# EAGLE design LCDClock (EAGLE 7.6.0)
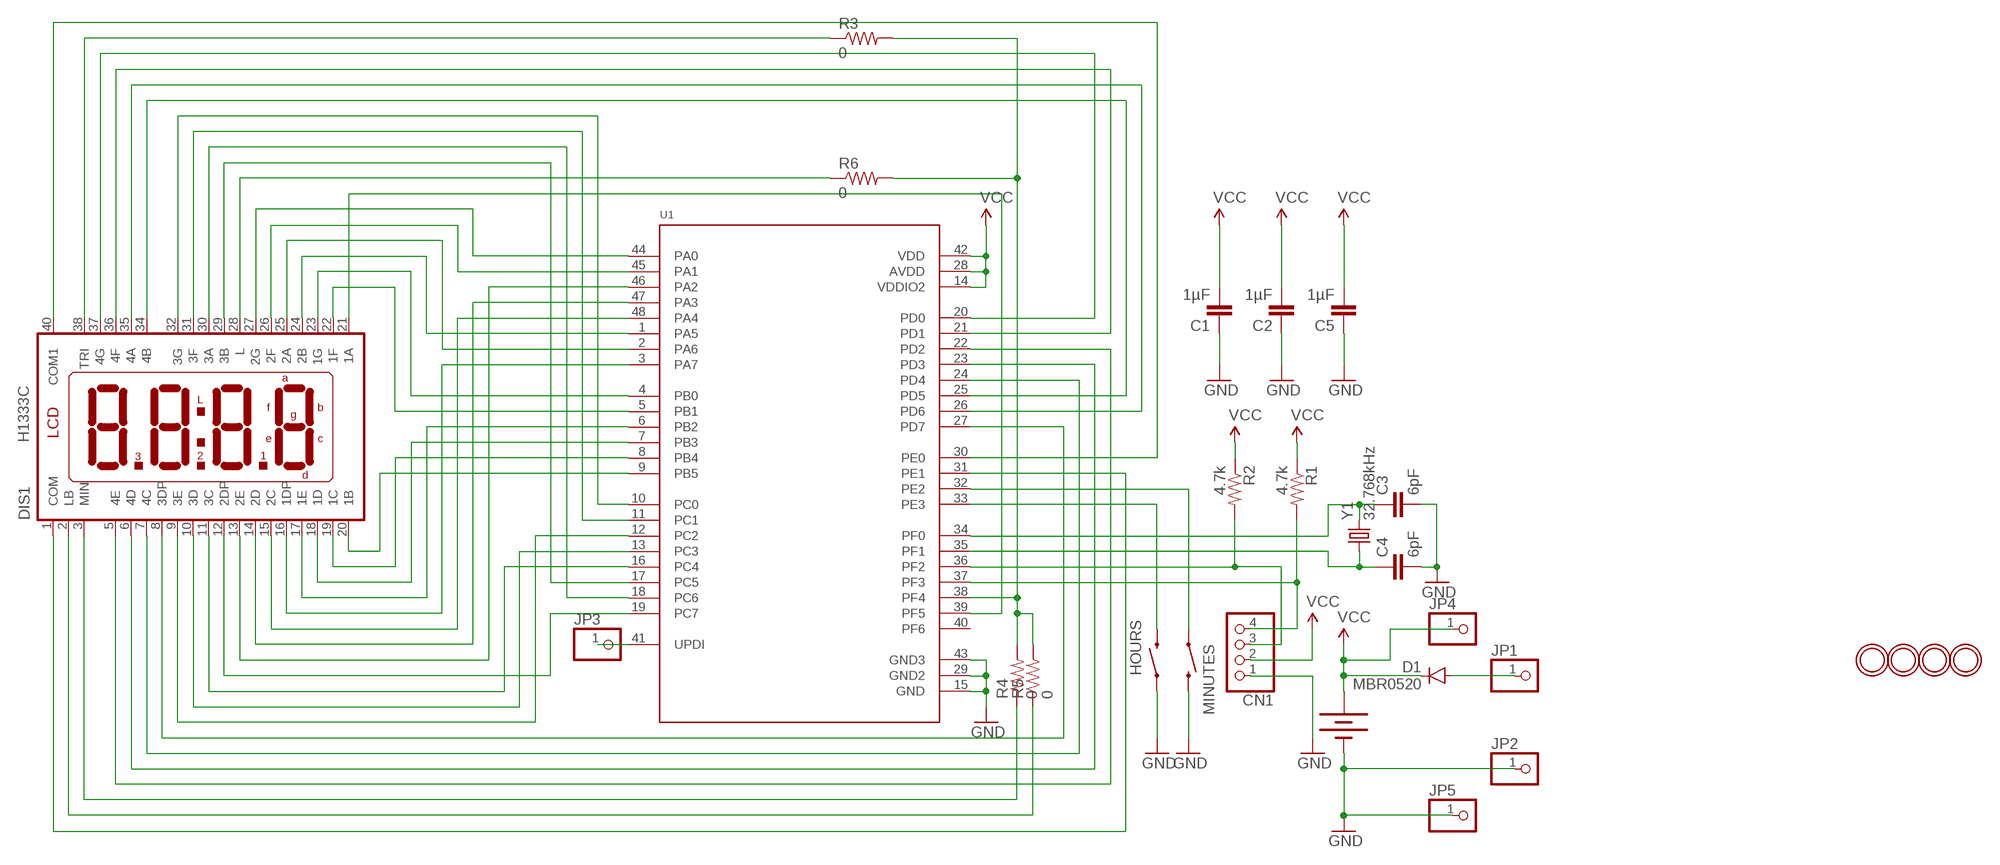
[diagram p0: schematic, sheet 1]

## Parts
BAT1  20mm coincell  BATTERY20MM_4LEGS  [BATTCON_20MM_4LEGS]
C1  1µF  CAP0805  [0805]
C2  1µF  CAP0805  [0805]
C3  6pF  CAP0805  [0805]
C4  6pF  CAP0805  [0805]
C5  1µF  CAP0805  [0805]
CN1  JST_4PIN  [JSTPH4]
D1  MBR0520  DIODESOD123  [SOD-123]
DIS1  H1333C  [H1333C]
HOURS  SWITCH-MOMENTARY-2SMD-4  [TACTILE_SWITCH_TALL]
JP1  HEADER-1X1ROUND  [1X01_ROUND]
JP2  HEADER-1X1ROUND  [1X01_ROUND]
JP3  HEADER-1X1ROUND  [1X01_ROUND]
JP4  HEADER-1X12MM  [1X01_2MM]
JP5  HEADER-1X12MM  [1X01_2MM]
MINUTES  SWITCH-MOMENTARY-2SMD-4  [TACTILE_SWITCH_TALL]
R1  4.7k  0.3OHM-1/8W-1%(0805)  [0805]
R2  4.7k  0.3OHM-1/8W-1%(0805)  [0805]
R3  0  0.3OHM-1/8W-1%(0805)  [0805]
R4  0  0.3OHM-1/8W-1%(0805)  [0805]
R5  0  0.3OHM-1/8W-1%(0805)  [0805]
R6  0  0.3OHM-1/8W-1%(0805)  [0805]
U1  AVR128DB48  [LQFP48]
U$1  MOUNTINGHOLE2.5  [MOUNTINGHOLE_2.5_PLATED]
U$4  MOUNTINGHOLE2.5  [MOUNTINGHOLE_2.5_PLATED]
U$5  MOUNTINGHOLE2.5  [MOUNTINGHOLE_2.5_PLATED]
U$9  MOUNTINGHOLE2.5  [MOUNTINGHOLE_2.5_PLATED]
Y1  32.768kHz  CRYSTAL3.2X1.5MM  [CRYSTAL-SMD-3.2X1.5MM]

## Nets
GND: BAT1.NEGATIVE(-) C1.1 C2.1 C3.2 C4.2 C5.1 CN1.1 HOURS.A2 JP2.1 JP5.1 MINUTES.B2 U1.15(GND) U1.29(GND2) U1.43(GND3)
N$1: DIS1.23(1G) U1.4(PB0)
N$2: DIS1.22(1F) U1.5(PB1)
N$3: DIS1.17(1E) U1.6(PB2)
N$4: DIS1.18(1D) U1.7(PB3)
N$5: DIS1.19(1C) U1.8(PB4)
N$6: DIS1.20(1B) U1.9(PB5)
N$7: DIS1.24(2B) U1.1(PA5)
N$8: DIS1.25(2A) U1.2(PA6)
N$9: DIS1.26(2F) U1.45(PA1)
N$10: MINUTES.A2 U1.32(PE2)
N$11: DIS1.27(2G) U1.44(PA0)
N$12: DIS1.16(1DP) U1.3(PA7)
N$13: HOURS.B2 U1.33(PE3)
N$14: DIS1.15(2C) U1.48(PA4)
N$15: DIS1.14(2D) U1.47(PA3)
N$16: DIS1.13(2E) U1.46(PA2)
N$17: DIS1.12(2DP) U1.19(PC7)
N$18: DIS1.11(3C) U1.16(PC4)
N$19: DIS1.10(3D) U1.13(PC3)
N$20: DIS1.9(3E) U1.12(PC2)
N$21: DIS1.29(3B) U1.17(PC5)
N$22: DIS1.30(3A) U1.18(PC6)
N$23: DIS1.31(3F) U1.11(PC1)
N$24: DIS1.32(3G) U1.10(PC0)
N$25: DIS1.34(4B) U1.25(PD5)
N$26: DIS1.35(4A) U1.26(PD6)
N$27: CN1.3 R2.2 U1.36(PF2)
N$28: DIS1.36(4F) U1.21(PD1)
N$29: CN1.4 R1.2 U1.37(PF3)
N$30: DIS1.37(4G) U1.20(PD0)
N$31: DIS1.8(3DP) U1.27(PD7)
N$32: DIS1.7(4C) U1.24(PD4)
N$33: DIS1.6(4D) U1.23(PD3)
N$34: DIS1.5(4E) U1.22(PD2)
N$35: DIS1.21(1A) U1.39(PF5)
N$37: R3.2 R4.2 R5.2 R6.2 U1.38(PF4)
N$38: DIS1.40(COM1) U1.30(PE0)
N$39: DIS1.1(COM) U1.31(PE1)
N$40: C4.1 U1.35(PF1) Y1.P$1
N$41: JP3.1 U1.41(UPDI)
N$42: C3.1 U1.34(PF0) Y1.P$2
N$43: DIS1.38(TRI) R3.1
N$44: DIS1.28(L) R6.1
N$45: DIS1.3(MIN) R4.1
N$46: DIS1.2(LB) R5.1
N$52: D1.A JP1.1
VCC: BAT1.POSITIVE@1(+) BAT1.POSITIVE@2(+) BAT1.POSITIVE@3(+) BAT1.POSITIVE@4(+) C1.2 C2.2 C5.2 CN1.2 D1.C JP4.1 R1.1 R2.1 U1.14(VDDIO2) U1.28(AVDD) U1.42(VDD)
Unconnected: U1.40(PF6)

## Library data of the parts
BAT1 = SparkFun-Electromechanical:BATTERY: Battery Holders Various common sizes : AA, AAA, 18650 (PRT-12895), 20mm coin cell and 12mm coin cell. 20MM_4LEGS, BATT-10373; PROD_ID: BATT-10373
C1-C5 = SparkFun-Capacitors:CAP: Capacitor Standard 0603 ceramic capacitor, and 0.1" leaded capacitor.
CN1 = microbuilder:JST_4PIN: JST 4-Pin Right-Angle Connector 4UConnector: 17312
D1 = SparkFun-DiscreteSemi:DIODE: Diode These are standard reverse protection diodes and small signal diodes. SMA package can handle up to about 1A. SOD-323 can handle about 200mA. What the SOD-323 package when ordering, there are some mfgs out there that are 5-pin packages.
DIS1 = technoblogy:H1333C: LCD DISPLAY 4-character 7 segment; OC_FARNELL: unknown; OC_NEWARK: unknown
HOURS MINUTES = SparkFun-Electromechanical:SWITCH-MOMENTARY-2: Various NO switches- pushbuttons, reed, etc; PROD_ID: SWCH-11966
JP1-JP5 = microbuilder:HEADER-1X1: PIN HEADER
R1-R6 = SparkFun-Resistors:0.3OHM-1/8W-1%(0805): RES-11622; PROD_ID: RES-11622; VALUE: 0.3
U1 = technoblogy:AVR128DB48: AVR128DB48 MCU QFP48 Package ARM Cortex M0, 50MHz Operation, 8 Channel 10-Bit ADC, 1²C, 2xSPI, UART, 2x16 Bit and 2x32 Bit Timers, Internal 12MHz Oscillator, 1.8-3.6V operation. Model Flash SRAM Part N°: Digikey Mouser LPC1113 24KB 8KB LPC1113FBD48/301 TBD TBD LPC1114 32KB 8KB LPC1114FBD48/301 568-4950-ND 771-LPC1114FBD483011; DIGIKEY#: 568-4950-ND; MANF: NXP; MANF#: LPC1114FBD48/301,1
U$1 U$4 U$5 U$9 = microbuilder:MOUNTINGHOLE: Mounting Hole For #2 screws (0.086"/2.18mm width, 0.094"/2.4mm hole) use 2.5mm; BOM: EXCLUDE
Y1 = SparkFun-FreqCtrl:CRYSTAL: Various standard crystals. Proven footprints.; PROD_ID: XTAL-13062

## Board
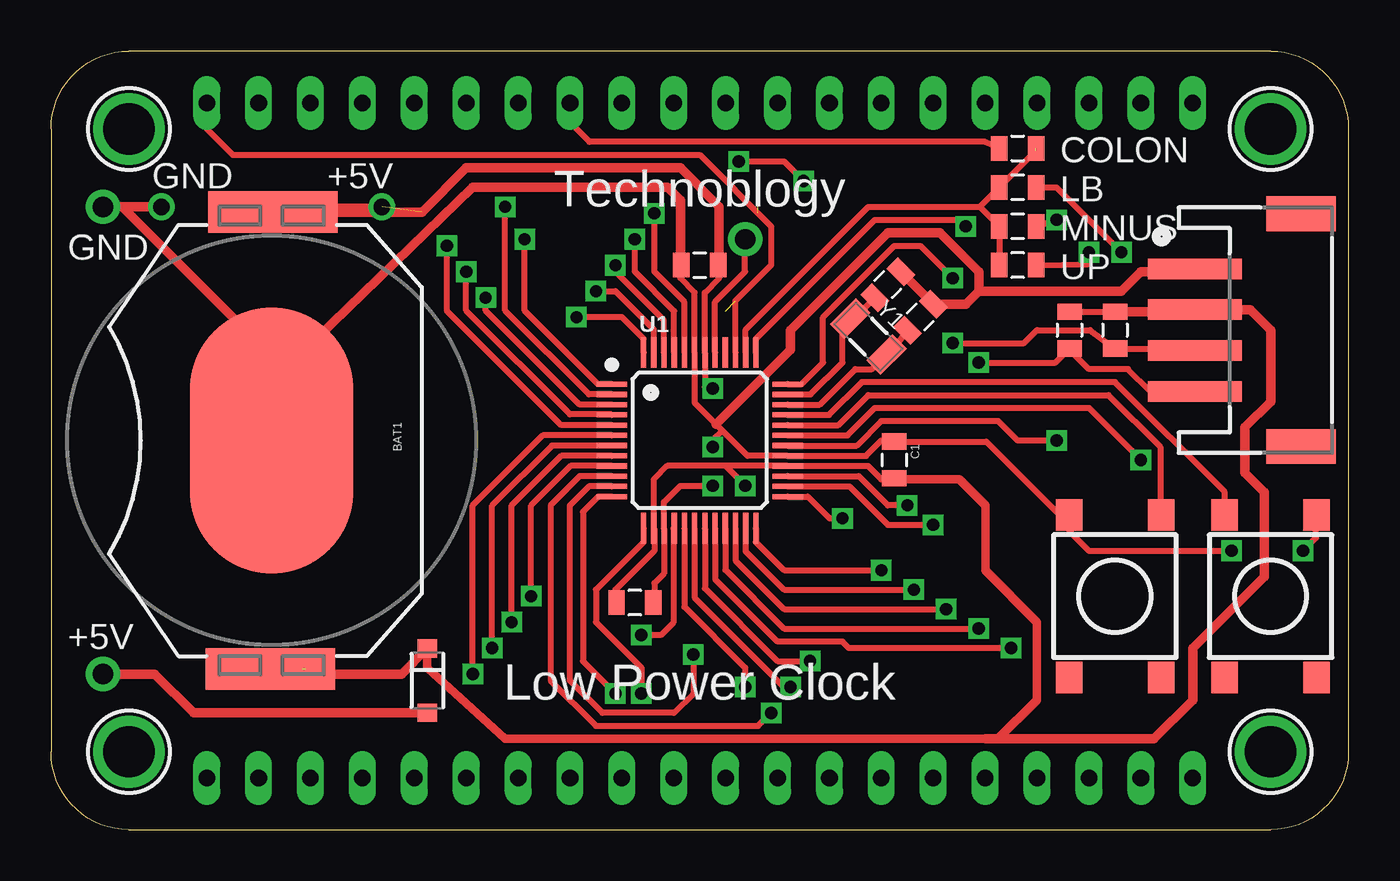
[diagram p1: board, top side]
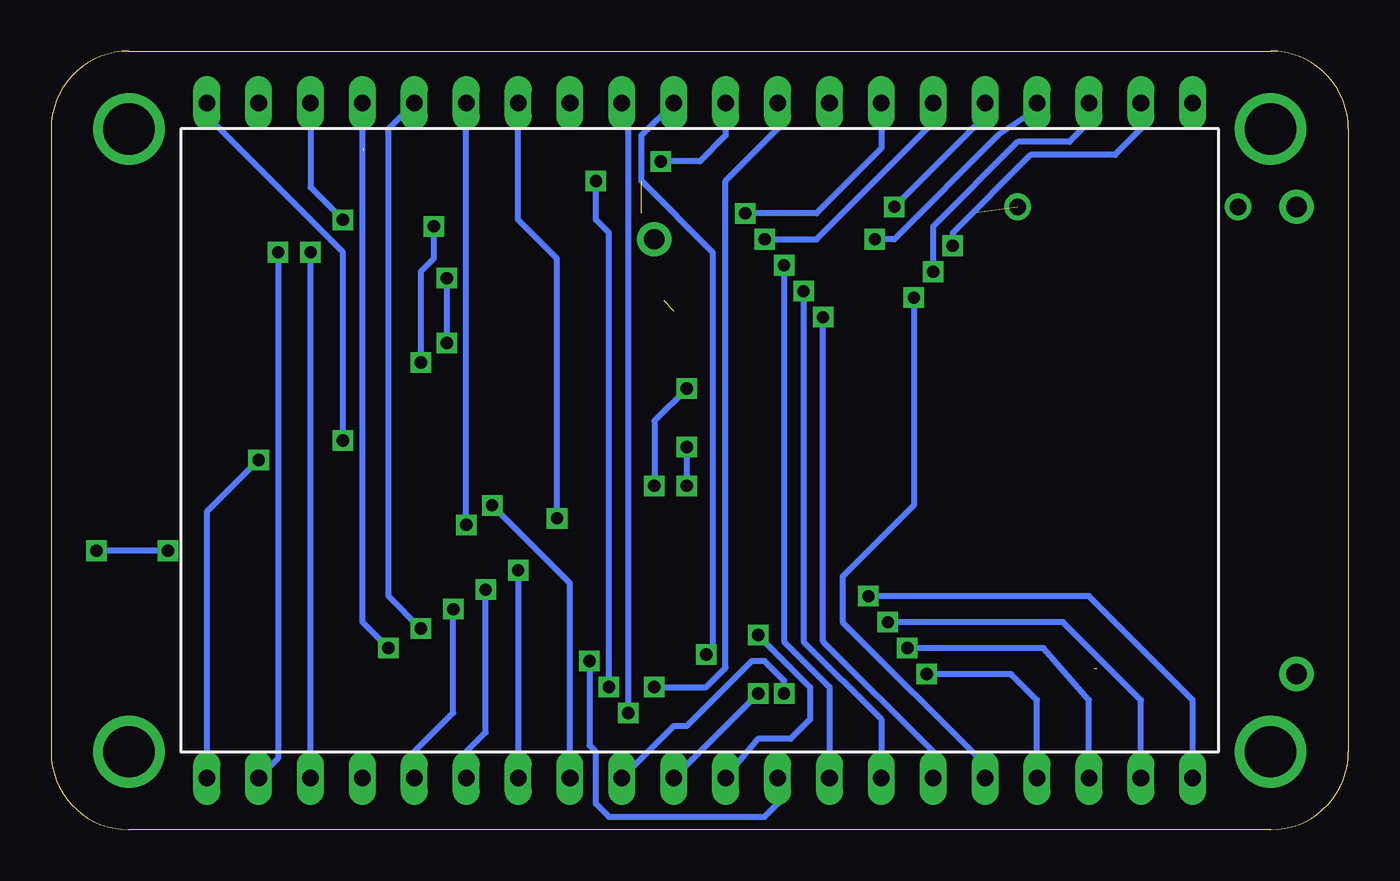
[diagram p2: board, bottom side, seen from below]

Size 63.5 x 38.1 mm. Coordinates in mm from the lower left corner, seen from the top.
Outline: 0,34.29 arc-90 3.81,38.1 59.69,38.1 arc-90 63.5,34.29 63.5,3.81 arc-90 59.69,0 3.81,0 arc-90 0,3.81 0,34.29
Copper layers (1*16): Top 0.035mm / dielectric 1.5mm / Bottom 0.035mm
Design rules "default *": minimum track width 10mil, minimum drill 24mil, track to track 6mil, track to pad 6mil, pad to pad 6mil, via to via 6mil, smd to smd 6mil, copper to edge 40mil, drill to drill 8mil, minimum pad ring 10mil, minimum via ring 8mil, stop-mask expansion 4mil, vias tented up to drill 25mil, thermal gap 10mil

### Footprints (pad centres in the part's own frame; a part is rotated, then mirrored left to right if it is on the bottom)
BATTCON_20MM_4LEGS = smd 13 x 8: NEGATIVE 0,0 | smd 2.032 x 3.175: POSITIVE@1 -11.176,1.651; POSITIVE@2 -11.176,-1.524; POSITIVE@3 11.176,1.524; POSITIVE@4 11.176,-1.651
0805 = smd 0.8 x 1.2: 1 -0.9,0; 2 0.9,0
JSTPH4 = smd 1 x 4.6: 1 -3,-3.7; 2 -1,-3.7; 3 1,-3.7; 4 3,-3.7 | smd 1.7 x 3.4: NC1 -5.7,1.5; NC2 5.7,1.5
SOD-123 = smd 0.9 x 0.95: A 1.575,0; C -1.575,0
H1333C = drill 0.813 long: 1 -24.13,-16.51; 2 -21.59,-16.51; 3 -19.05,-16.51; 4 -16.51,-16.51; 5 -13.97,-16.51; 6 -11.43,-16.51; 7 -8.89,-16.51; 8 -6.35,-16.51; 9 -3.81,-16.51; 10 -1.27,-16.51; 11 1.27,-16.51; 12 3.81,-16.51; 13 6.35,-16.51; 14 8.89,-16.51; 15 11.43,-16.51; 16 13.97,-16.51; 17 16.51,-16.51; 18 19.05,-16.51; 19 21.59,-16.51; 20 24.13,-16.51; 21 24.13,16.51; 22 21.59,16.51; 23 19.05,16.51; 24 16.51,16.51; 25 13.97,16.51; 26 11.43,16.51; 27 8.89,16.51; 28 6.35,16.51; 29 3.81,16.51; 30 1.27,16.51; 31 -1.27,16.51; 32 -3.81,16.51; 33 -6.35,16.51; 34 -8.89,16.51; 35 -11.43,16.51; 36 -13.97,16.51; 37 -16.51,16.51; 38 -19.05,16.51; 39 -21.59,16.51; 40 -24.13,16.51
TACTILE_SWITCH_TALL = smd 1.55 x 1.3: A1 -3.975,-2.25; A2 3.975,-2.25; B1 -3.975,2.25; B2 3.975,2.25
1X01_ROUND = drill 1 pad 1.676: 1 0,0
1X01_2MM = drill 0.8 pad 1.27: 1 0,0
LQFP48 = smd 1.5 x 0.25: 1 -4.3,2.75; 2 -4.3,2.25; 3 -4.3,1.75; 4 -4.3,1.25; 5 -4.3,0.75; 6 -4.3,0.25; 7 -4.3,-0.25; 8 -4.3,-0.75; 9 -4.3,-1.25; 10 -4.3,-1.75; 11 -4.3,-2.25; 12 -4.3,-2.75; 25 4.3,-2.75; 26 4.3,-2.25; 27 4.3,-1.75; 28 4.3,-1.25; 29 4.3,-0.75; 30 4.3,-0.25; 31 4.3,0.25; 32 4.3,0.75; 33 4.3,1.25; 34 4.3,1.75; 35 4.3,2.25; 36 4.3,2.75 | smd 0.25 x 1.5: 13 -2.75,-4.3; 14 -2.25,-4.3; 15 -1.75,-4.3; 16 -1.25,-4.3; 17 -0.75,-4.3; 18 -0.25,-4.3; 19 0.25,-4.3; 20 0.75,-4.3; 21 1.25,-4.3; 22 1.75,-4.3; 23 2.25,-4.3; 24 2.75,-4.3; 37 2.75,4.3; 38 2.25,4.3; 39 1.75,4.3; 40 1.25,4.3; 41 0.75,4.3; 42 0.25,4.3; 43 -0.25,4.3; 44 -0.75,4.3; 45 -1.25,4.3; 46 -1.75,4.3; 47 -2.25,4.3; 48 -2.75,4.3
MOUNTINGHOLE_2.5_PLATED = drill 2.5 pad 3.2: P$1 0,0
CRYSTAL-SMD-3.2X1.5MM = smd 1 x 1.8: P$1 -1.25,0; P$2 1.25,0

### Placement (x,y rotation side)
BAT1  10.79,19.05 270 top
C1  41.27,18.1 270 top
C2  28.57,11.11 180 top
C3  42.55,25.08 45 top
C4  40.96,26.67 45 top
C5  31.75,27.62 0 top
CN1  59.69,24.45 270 top
D1  18.41,7.3 270 top
DIS1  31.75,19.05 0 bottom
HOURS  59.69,11.43 90 top
JP1  2.54,7.62 0 top
JP2  2.54,30.48 0 top
JP3  33.97,28.89 0 top
JP4  16.19,30.48 0 top
JP5  5.4,30.48 0 top
MINUTES  52.07,11.43 90 top
R1  49.85,24.45 270 top
R2  52.07,24.45 270 top
R3  47.31,29.53 180 top
R4  47.31,27.62 180 top
R5  47.31,31.43 180 top
R6  47.31,33.34 0 top
U1  31.75,19.05 0 top
U$1  59.69,34.29 0 top
U$4  59.69,3.81 0 top
U$5  3.81,3.81 0 top
U$9  3.81,34.29 0 top
Y1  40.01,24.13 315 top

### Tracks (layer width: path | path; a pad name or v marks a point on that pad's centre or on a via)
GND  (via drill 0.6)
  Top 0.305: C2.1 29.53,11.16 29.53,12.06 30,12.54 U1.15 30,16.03 30.8,16.83 v32.38,16.83 | MINUTES.B2 49.82,15.27 | BAT1.NEGATIVE 11.43,22.54 | 30.8,27.68 C5.1 30.8,27.25 30.8,26.99 31.5,26.29 U1.43 31.5,20.89 32.54,19.84 32.86,19.53 | 55.85,27.3 CN1.1 | 49.66,15.24 MINUTES.B2 | 32.86,19.53 34.09,18.3 U1.29 39.89,18.3 40.64,19.05 41.22,19.05 C1.1 45.77,19 49.21,15.56 49.67,15.56 MINUTES.B2 | MINUTES.B2 49.82,14.63 50.8,13.65 v57.78,13.65 | v61.28,13.65 61.91,14.29 61.91,15.38 HOURS.A2 | v32.38,18.73 32.38,19.05 32.86,19.53
  Top 0.457: C4.2 C3.2 44.77,25.72 45.4,26.35 | 30.8,27.68 30.8,30.8 30.16,31.43 20.64,31.43 11.43,22.54 3.49,30.48 JP2.1 JP5.1 | 55.85,27.3 53.34,27.3 52.39,26.35 45.4,26.35 | 45.4,26.35 45.4,27.3 43.5,29.21 40.96,29.21 36.2,24.45 36.2,23.5 32.54,19.84
  Bottom 0.305: v57.78,13.65 v61.28,13.65 | v32.38,16.83 v32.38,18.73
N$1  (via drill 0.6)
  Top 0.305: U1.4 27.43,20.32 25.4,20.32 20.32,25.4 v20.32,27.3
  Bottom 0.305: DIS1.23 12.7,34.61 13.65,33.66 16.19,33.66 20.32,29.53 v20.32,27.3
N$2  (via drill 0.6)
  Top 0.305: U1.5 24.97,19.8 19.37,25.4 v19.37,28.57
  Bottom 0.305: DIS1.22 10.16,34.29 11.43,33.02 15.56,33.02 19.37,29.21 v19.37,28.57
N$3  (via drill 0.6)
  Top 0.305: U1.6 24.06,19.3 20.64,15.88 v20.64,7.62
  Bottom 0.305: DIS1.17 15.24,6.35 16.51,7.62 v20.64,7.62
N$4  (via drill 0.6)
  Top 0.305: U1.7 24.52,18.8 21.59,15.88 v21.59,8.89
  Bottom 0.305: DIS1.18 12.7,6.35 14.92,8.89 v21.59,8.89
N$5  (via drill 0.6)
  Top 0.305: U1.8 24.97,18.3 22.54,15.88 v22.54,10.16
  Bottom 0.305: DIS1.19 10.16,6.35 13.97,10.16 v22.54,10.16
N$6  (via drill 0.6)
  Top 0.305: U1.9 25.42,17.8 23.5,15.88 v23.5,11.43
  Bottom 0.305: DIS1.20 7.62,6.35 12.7,11.43 v23.5,11.43
N$7  (via drill 0.6)
  Top 0.305: U1.1 26.78,21.8 23.18,25.4 v23.18,28.89
  Bottom 0.305: DIS1.24 15.24,35.24 17.14,33.97 22.23,28.89 v23.18,28.89
N$8  (via drill 0.6)
  Top 0.305: U1.2 26.32,21.3 22.23,25.4 v22.23,30.48
  Bottom 0.305: DIS1.25 17.78,34.92 v22.23,30.48
N$9  (via drill 0.6)
  Top 0.305: U1.45 30.5,25.38 28.57,27.3 v28.57,28.89
  Bottom 0.305: DIS1.26 20.32,34.61 26.04,28.89 v28.57,28.89
N$10
  Top 0.305: U1.32 38.53,19.8 40.01,21.27 51.75,21.27 54.29,18.73 54.29,15.43 MINUTES.A2
N$11  (via drill 0.6)
  Top 0.305: U1.44 31,25.83 29.53,27.3 v29.53,30.16
  Bottom 0.305: DIS1.27 22.86,33.34 26.04,30.16 v29.53,30.16
N$12  (via drill 0.6)
  Top 0.305: U1.3 25.87,20.8 21.27,25.4 v21.27,26.04
  Bottom 0.305: v21.27,26.04 21.27,15.88 24.77,12.38 24.77,10.16 17.78,3.17 DIS1.16
N$13
  Top 0.305: U1.33 38.08,20.3 39.69,21.91 52.07,21.91 57.44,16.54 HOURS.B2
N$14  (via drill 0.6)
  Top 0.305: v25.72,25.08 27.94,25.08 29,24.02 U1.48
  Bottom 0.305: DIS1.15 20.32,3.81 25.72,9.21 v25.72,25.08
N$15  (via drill 0.6)
  Top 0.305: U1.47 29.5,24.48 27.62,26.35 v26.67,26.35
  Bottom 0.305: v26.67,26.35 26.67,9.21 22.86,5.4 DIS1.14
N$16  (via drill 0.6)
  Top 0.305: U1.46 30,24.93 27.62,27.3 v27.62,27.62
  Bottom 0.305: v27.62,27.62 27.62,9.21 25.4,6.99 DIS1.13
N$17  (via drill 0.6)
  Top 0.305: U1.19 32,11.81 35.56,8.26 v37.15,8.26
  Bottom 0.305: v37.15,8.26 37.15,4.13 36.83,3.81 36.83,1.27 36.2,0.64 28.57,0.64 27.94,1.27 DIS1.12
N$18  (via drill 0.6)
  Top 0.305: U1.16 30.46,14.75 30.46,10.14 29.84,9.53 v28.89,9.53
  Bottom 0.305: v28.89,9.53 26.35,6.99 26.35,5.4 27.3,4.45 28.89,4.45 DIS1.11
N$19  (via drill 0.6)
  Top 0.305: U1.13 29,14.08 26.67,11.75 26.67,10.16 28.89,7.94 v28.89,6.67
  Bottom 0.305: v28.89,6.67 DIS1.10
N$20  (via drill 0.6)
  Top 0.305: U1.12 26.78,16.3 26.04,15.56 26.04,8.26 v27.62,6.67
  Bottom 0.305: DIS1.9 33.02,5.08 32.38,5.08 29.21,8.26 28.57,8.26 27.62,7.3 v27.62,6.67
N$21  (via drill 0.6)
  Top 0.305: U1.17 31,10.91 33.97,7.94 v33.97,6.99
  Bottom 0.305: v33.97,6.99 31.43,6.99 30.48,7.94 30.48,31.75 27.94,34.29 DIS1.29
N$22  (via drill 0.6)
  Top 0.305: U1.18 31.5,11.36 35.88,6.99 v36.2,6.99 | v33.66,32.7 35.88,32.7 v36.83,31.75
  Bottom 0.305: v36.2,6.99 36.2,29.21 36.83,29.84 v36.83,31.75 | v33.66,32.7 31.75,32.7 30.48,33.97 DIS1.30
N$23  (via drill 0.6)  (1 unrouted)
  Top 0.305: U1.11 26.32,16.8 25.4,15.88 25.4,7.3 26.99,5.71 30.48,5.71 31.43,6.67 v31.43,8.57
  Bottom 0.305: v31.43,8.57 31.11,8.89 31.11,28.26 34.61,31.75 34.61,33.97 DIS1.31
N$24  (via drill 0.6)
  Top 0.305: U1.10 25.87,17.3 24.45,15.88 24.45,7.3 26.67,5.08 34.61,5.08 v35.24,5.71
  Bottom 0.305: v35.24,5.71 35.24,35.24 DIS1.32
N$25  (via drill 0.6)
  Top 0.305: U1.25 37.04,16.3 38.1,15.24 v38.73,15.24
  Bottom 0.305: v38.73,15.24 38.73,27.94 40.64,29.84 DIS1.34
N$26  (via drill 0.6)
  Top 0.305: U1.26 39.08,16.8 40.96,14.92 v43.18,14.92
  Bottom 0.305: v43.18,14.92 DIS1.35
N$27  (via drill 0.6)
  Top 0.305: U1.36 36.72,21.8 37.78,22.86 37.78,25.08 41.27,28.57 42.55,28.57 v44.13,26.99 | 55.94,23.5 CN1.3 55.89,23.55 R2.2 50.85,24.45 48.26,24.45 47.62,23.81 v44.13,23.81
  Bottom 0.305: v44.13,26.99 v44.13,23.81
N$28  (via drill 0.6)
  Top 0.305: U1.21 33,12.72 35.88,9.84 v45.4,9.84
  Bottom 0.305: DIS1.36 46.99,34.29 46.99,11.43 v45.4,9.84
N$29  (via drill 0.6)
  Top 0.305: U1.37 34.5,24.02 40.32,29.84 44.45,29.84 v44.77,29.53 | CN1.4 53.8,21.45 52.7,22.54 50.8,22.54 49.85,23.5 R1.2 49.16,22.86 v45.4,22.86
  Bottom 0.305: v44.77,29.53 44.77,27.94 45.4,27.3 v45.4,22.86
N$30  (via drill 0.6)
  Top 0.305: U1.20 32.5,12.27 35.56,9.21 38.73,9.21 39.05,8.89 v46.99,8.89
  Bottom 0.305: v46.99,8.89 48.26,10.16 DIS1.37
N$31  (via drill 0.6)
  Top 0.305: U1.27 39.53,17.3 40.96,15.88 v41.91,15.88
  Bottom 0.305: DIS1.8 38.1,12.06 v41.91,15.88
N$32  (via drill 0.6)
  Top 0.305: U1.24 34.5,14.08 35.88,12.7 v40.64,12.7
  Bottom 0.305: v40.64,12.7 DIS1.7
N$33  (via drill 0.6)
  Top 0.305: U1.23 34,13.62 35.88,11.75 v42.23,11.75
  Bottom 0.305: DIS1.6 43.18,3.81 42.23,4.76 v42.23,11.75
N$34  (via drill 0.6)
  Top 0.305: U1.22 33.5,13.17 35.88,10.79 v43.81,10.79
  Bottom 0.305: DIS1.5 45.72,3.81 43.81,5.71 v43.81,10.79
N$35  (1 unrouted)
  Top 0.305: DIS1.21 7.62,34.29 8.89,33.02 31.75,33.02 35.24,29.53 35.24,27.62 33.5,25.88 33.5,25.87 U1.39
N$37  (1 unrouted)
  Top 0.305: U1.38 34,24.48 40.01,30.48 45.45,30.48 | R4.2 R3.2 45.45,30.48 | 48.21,33.23 R5.2 45.45,30.48
N$38  (via drill 0.6)
  Top 0.305: U1.30 39.44,18.8 40.64,20 46.35,20 47.31,19.05 v49.21,19.05
  Bottom 0.305: v49.21,19.05 49.21,28.26 55.88,34.92 DIS1.40
N$39  (via drill 0.6)
  Top 0.305: U1.31 38.98,19.3 40.32,20.64 50.8,20.64 v53.34,18.1
  Bottom 0.305: v53.34,18.1 55.88,15.56 DIS1.1
N$40
  Top 0.305: U1.35 37.17,21.3 38.73,22.86 38.73,24.63 Y1.P$1 39.12,25.15 39.37,25.4 39.69,25.4 C4.1
N$41
  Top 0.305: U1.41 32.5,25.83 33.97,27.3 JP3.1
N$42
  Top 0.305: U1.34 37.63,20.8 39.37,22.54 40.19,22.54 Y1.P$2 41.03,23.25 C3.1
N$43  (via drill 0.6)
  Top 0.305: R3.1 v49.21,29.84
  Bottom 0.305: v49.21,29.84 50.8,31.43 DIS1.38
N$44
  Top 0.305: R6.1 45.72,33.66 26.35,33.66 25.4,34.61 DIS1.28
N$45  (via drill 0.6)
  Top 0.305: R4.1 50.75,27.68 v50.8,28.26
  Bottom 0.305: DIS1.3 v50.8,28.26
N$46  (via drill 0.6)
  Top 0.305: R5.1 49.21,31.43 v52.39,28.26
  Bottom 0.305: v52.39,28.26 52.39,3.49 DIS1.2
N$52
  Top 0.457: D1.A 6.97,5.73 5.08,7.62 JP1.1
VCC  (via drill 0.6)  (2 unrouted)
  Top 0.305: C1.2 41.22,17.14 40.64,17.14 39.98,17.8 U1.28 33.02,17.8 | C2.2 27.62,11.16 27.62,11.75 29.53,13.65 29.53,14.72 U1.14 29.5,17.14 30.16,17.8 33.02,17.8 | R1.1 R2.1 | 32.7,27.68 C5.2 32.7,27.57 32.7,26.99 32,26.29 U1.42 32,21.66 v32.38,21.59 | 11.43,7.62 9.78,7.62 BAT1.POSITIVE@4 12.45,7.87 12.7,7.62 | 55.89,25.35 CN1.2 | v33.97,16.83 33.97,16.85 33.02,17.8 | JP4.1 9.53,30.48 BAT1.POSITIVE@2
  Top 0.406: D1.C 18.41,7.94 22.23,4.45 45.72,4.45 46.35,4.45 48.26,6.35 48.26,10.16 45.72,12.7 45.72,15.88 44.45,17.14 41.33,17.14 C1.2
  Top 0.457: BAT1.POSITIVE@1 18.16,30.23 20.32,32.38 30.8,32.38 32.7,30.48 32.7,27.68 | D1.C 17.16,7.62 12.7,7.62 | CN1.2 58.69,25.45 59.69,24.45 59.69,20.95 58.42,19.68 58.42,17.46 59.37,16.51 59.37,12.38 55.88,8.89 55.88,6.35 53.98,4.45 45.72,4.45 | R2.1 55.89,25.35
  Bottom 0.305: v32.38,21.59 33.97,20 v33.97,16.83

### Text on the board
tPlace: COLON | GND | +5V | LB | Technoblogy | MINUS | GND | UP | +5V | Low Power Clock